# Altium schematic sheet supply.SchDoc
size A3; DocumentNumber: 41; SheetNumber: 41; SheetTotal: 45; SheetDescription: Board Power Supply
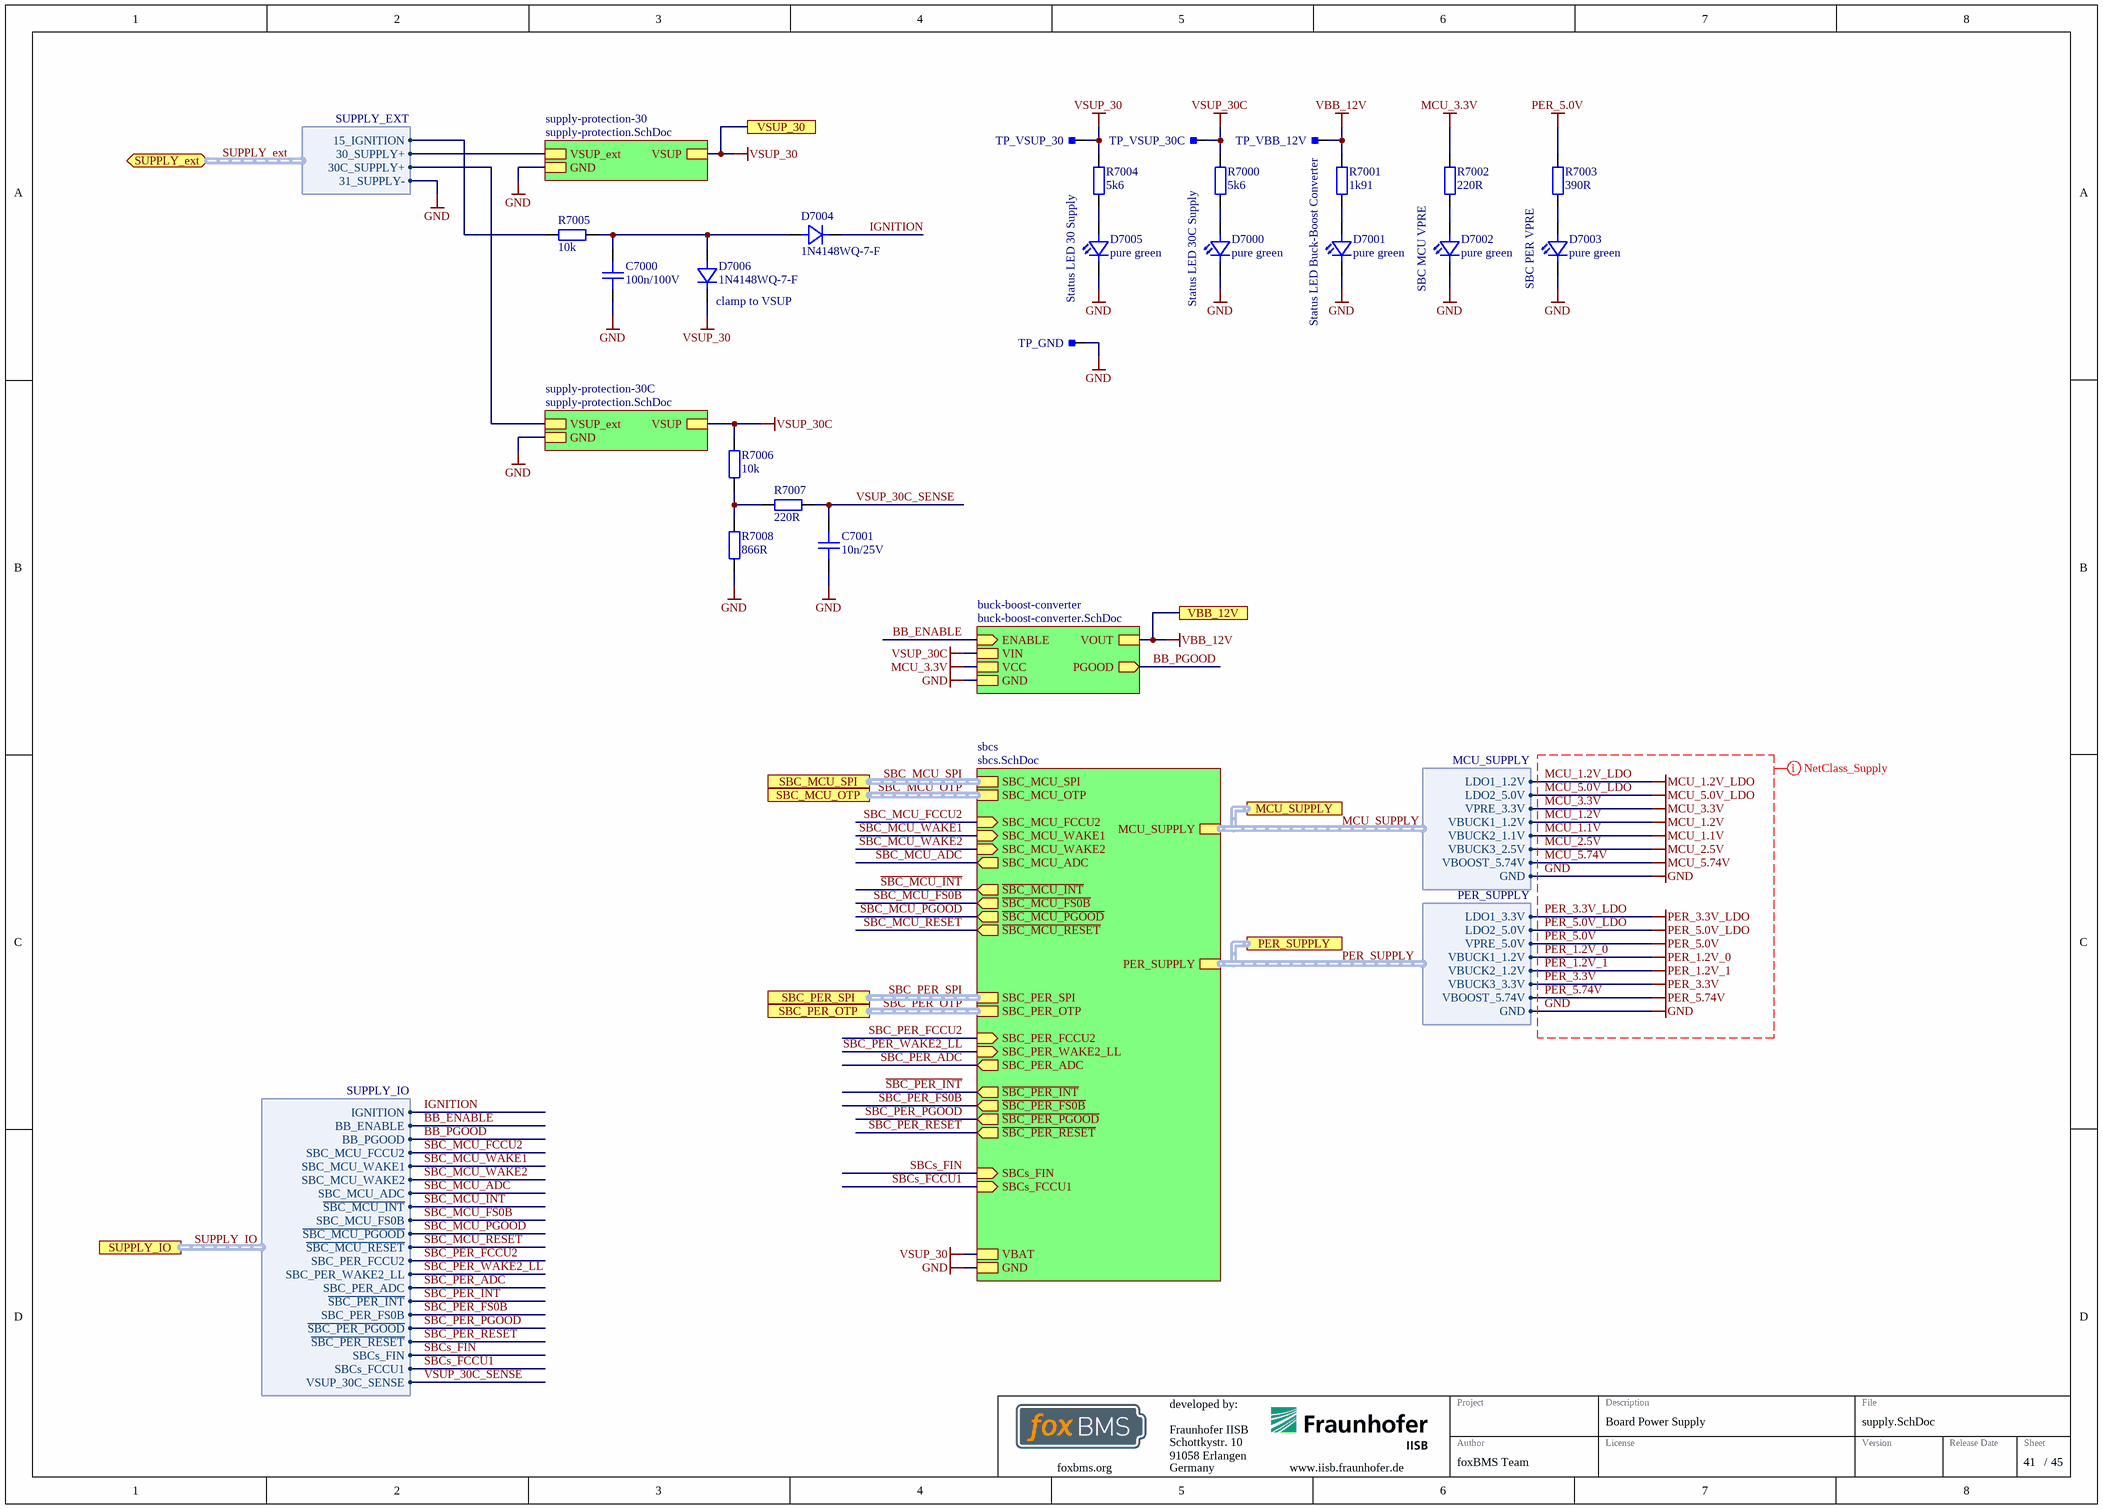
[diagram p0: supply.SchDoc]

## Parts
C7000  100n/100V  [CAPC1608X08N]
C7001  10n/25V  [CAPC1005X06N]
D7000  pure green  [LEDC1608X07N]
D7001  pure green  [LEDC1608X07N]
D7002  pure green  [LEDC1608X07N]
D7003  pure green  [LEDC1608X07N]
D7004  1N4148WQ-7-F  [SOD-123_CASE-425-04-ISSUE-G]
D7005  pure green  [LEDC1608X07N]
D7006  1N4148WQ-7-F  [SOD-123_CASE-425-04-ISSUE-G]
R7000  5k6  [RESC1005X04N]
R7001  1k91  [RESC1005X04N]
R7002  220R  [RESC1005X04N]
R7003  390R  [RESC1005X04N]
R7004  5k6  [RESC1005X04N]
R7005  10k  [RESC1005X04N]
R7006  10k  [RESC1005X04N]
R7007  220R  [RESC1005X04N]
R7008  866R  [RESC1005X04N]
TP_GND  Testpoint_Square  [Testpoint_S1]  (value not drawn)  (no BOM)
TP_VBB_12V  Testpoint_Square  [Testpoint_S1]  (value not drawn)  (no BOM)
TP_VSUP_30  Testpoint_Square  [Testpoint_S1]  (value not drawn)  (no BOM)
TP_VSUP_30C  Testpoint_Square  [Testpoint_S1]  (value not drawn)  (no BOM)

## Sub-sheets
buck-boost-converter = buck-boost-converter.SchDoc: VIN, VOUT, PGOOD (out), GND, VCC, ENABLE (in)
sbcs = sbcs.SchDoc: VBAT, GND, SBC_MCU_SPI (harness SPI), PER_SUPPLY (harness PER_SUPPLY), SBC_MCU_WAKE2 (in), SBC_PER_ADC (out), SBC_PER_OTP (harness SBC_OTP), SBC_MCU_FCCU2 (in), SBC_PER_FCCU2 (in), ~{SBC_PER_INT} (out), ~{SBC_MCU_FS0B} (out), ~{SBC_PER_FS0B} (out), SBC_MCU_ADC (out), ~{SBC_MCU_INT} (out), MCU_SUPPLY (harness MCU_SUPPLY), SBC_PER_WAKE2_LL (in), SBC_MCU_OTP (harness SBC_OTP), SBC_MCU_WAKE1 (in), SBC_PER_SPI (harness SPI), SBCs_FIN (in), ~{SBC_MCU_PGOOD} (out), ~{SBC_MCU_RESET} (out), SBCs_FCCU1 (in), ~{SBC_PER_PGOOD} (out), ~{SBC_PER_RESET} (out)
supply-protection-30 = supply-protection.SchDoc: VSUP, GND, VSUP_ext
supply-protection-30C = supply-protection.SchDoc: VSUP, GND, VSUP_ext

## Ports
MCU_SUPPLY (harness MCU_SUPPLY), PER_SUPPLY (harness PER_SUPPLY), SBC_MCU_OTP (harness SBC_OTP), SBC_MCU_SPI (harness SPI), SBC_PER_OTP (harness SBC_OTP), SBC_PER_SPI (harness SPI), SUPPLY_ext (bidir, harness SUPPLY_EXT), SUPPLY_IO (harness SUPPLY_IO), VBB_12V, VSUP_30

## Harnesses
MCU_SUPPLY: VBUCK1_1.2V, VBUCK2_1.1V, VBUCK3_2.5V, LDO1_1.2V, LDO2_5.0V, GND, VPRE_3.3V, VBOOST_5.74V
PER_SUPPLY: GND, VBOOST_5.74V, LDO1_3.3V, LDO2_5.0V, VPRE_5.0V, VBUCK1_1.2V, VBUCK2_1.2V, VBUCK3_3.3V
SUPPLY_IO: IGNITION, BB_ENABLE, BB_PGOOD, SBC_MCU_FCCU2, SBC_MCU_WAKE1, SBC_MCU_WAKE2, SBC_MCU_ADC, ~{SBC_MCU_INT}, SBC_MCU_FS0B, ~{SBC_MCU_PGOOD}, ~{SBC_MCU_RESET}, SBC_PER_FCCU2, SBC_PER_WAKE2_LL, SBC_PER_ADC, ~{SBC_PER_INT}, SBC_PER_FS0B, SBCs_FIN, SBCs_FCCU1, ~{SBC_PER_PGOOD}, ~{SBC_PER_RESET}, VSUP_30C_SENSE
SUPPLY_EXT: 30_SUPPLY+, 31_SUPPLY-, 15_IGNITION, 30C_SUPPLY+

## Nets
GND: C7000.1 C7001.1 D7000.1(C) D7001.1(C) D7002.1(C) D7003.1(C) D7005.1(C) R7008.1 TP_GND.1 ; sheet buck-boost-converter/GND, sheet supply-protection-30/GND, sheet sbcs/GND, sheet supply-protection-30C/GND, port MCU_SUPPLY.GND, port PER_SUPPLY.GND, port SUPPLY_ext.31_SUPPLY-
MCU_1.1V: port MCU_SUPPLY.VBUCK2_1.1V
MCU_1.2V: port MCU_SUPPLY.VBUCK1_1.2V
MCU_1.2V_LDO: port MCU_SUPPLY.LDO1_1.2V
MCU_2.5V: port MCU_SUPPLY.VBUCK3_2.5V
MCU_3.3V: R7002.2 ; sheet buck-boost-converter/VCC, port MCU_SUPPLY.VPRE_3.3V
MCU_5.0V_LDO: port MCU_SUPPLY.LDO2_5.0V
MCU_5.74V: port MCU_SUPPLY.VBOOST_5.74V
PER_1.2V_0: port PER_SUPPLY.VBUCK1_1.2V
PER_1.2V_1: port PER_SUPPLY.VBUCK2_1.2V
PER_3.3V: port PER_SUPPLY.VBUCK3_3.3V
PER_3.3V_LDO: port PER_SUPPLY.LDO1_3.3V
PER_5.0V: R7003.2 ; port PER_SUPPLY.VPRE_5.0V
PER_5.0V_LDO: port PER_SUPPLY.LDO2_5.0V
PER_5.74V: port PER_SUPPLY.VBOOST_5.74V
VBB_12V: R7001.2 TP_VBB_12V.1 ; port VBB_12V, sheet buck-boost-converter/VOUT
VSUP_30: D7006.1(K) R7004.2 TP_VSUP_30.1 ; port VSUP_30, sheet supply-protection-30/VSUP, sheet sbcs/VBAT
VSUP_30C: R7000.2 R7006.2 TP_VSUP_30C.1 ; sheet buck-boost-converter/VIN, sheet supply-protection-30C/VSUP
~{SBC_MCU_INT}: sheet sbcs/~{SBC_MCU_INT}, port SUPPLY_IO.~{SBC_MCU_INT}
~{SBC_MCU_PGOOD}: sheet sbcs/~{SBC_MCU_PGOOD}, port SUPPLY_IO.~{SBC_MCU_PGOOD}
~{SBC_MCU_RESET}: sheet sbcs/~{SBC_MCU_RESET}, port SUPPLY_IO.~{SBC_MCU_RESET}
~{SBC_PER_INT}: sheet sbcs/~{SBC_PER_INT}, port SUPPLY_IO.~{SBC_PER_INT}
~{SBC_PER_PGOOD}: sheet sbcs/~{SBC_PER_PGOOD}, port SUPPLY_IO.~{SBC_PER_PGOOD}
~{SBC_PER_RESET}: sheet sbcs/~{SBC_PER_RESET}, port SUPPLY_IO.~{SBC_PER_RESET}
BB_ENABLE: sheet buck-boost-converter/ENABLE, port SUPPLY_IO.BB_ENABLE
BB_PGOOD: sheet buck-boost-converter/PGOOD, port SUPPLY_IO.BB_PGOOD
IGNITION: D7004.1(K) ; port SUPPLY_IO.IGNITION
SBC_MCU_ADC: sheet sbcs/SBC_MCU_ADC, port SUPPLY_IO.SBC_MCU_ADC
SBC_MCU_FCCU2: sheet sbcs/SBC_MCU_FCCU2, port SUPPLY_IO.SBC_MCU_FCCU2
SBC_MCU_FS0B: sheet sbcs/~{SBC_MCU_FS0B}, port SUPPLY_IO.SBC_MCU_FS0B
SBC_MCU_WAKE1: sheet sbcs/SBC_MCU_WAKE1, port SUPPLY_IO.SBC_MCU_WAKE1
SBC_MCU_WAKE2: sheet sbcs/SBC_MCU_WAKE2, port SUPPLY_IO.SBC_MCU_WAKE2
SBC_PER_ADC: sheet sbcs/SBC_PER_ADC, port SUPPLY_IO.SBC_PER_ADC
SBC_PER_FCCU2: sheet sbcs/SBC_PER_FCCU2, port SUPPLY_IO.SBC_PER_FCCU2
SBC_PER_FS0B: sheet sbcs/~{SBC_PER_FS0B}, port SUPPLY_IO.SBC_PER_FS0B
SBC_PER_WAKE2_LL: sheet sbcs/SBC_PER_WAKE2_LL, port SUPPLY_IO.SBC_PER_WAKE2_LL
SBCs_FCCU1: sheet sbcs/SBCs_FCCU1, port SUPPLY_IO.SBCs_FCCU1
SBCs_FIN: sheet sbcs/SBCs_FIN, port SUPPLY_IO.SBCs_FIN
SUPPLY_ext.15_IGNITION: R7005.2 ; port SUPPLY_ext.15_IGNITION
SUPPLY_ext.30_SUPPLY+: sheet supply-protection-30/VSUP_ext, port SUPPLY_ext.30_SUPPLY+
SUPPLY_ext.30C_SUPPLY+: sheet supply-protection-30C/VSUP_ext, port SUPPLY_ext.30C_SUPPLY+
VSUP_30C_SENSE: C7001.2 R7007.2 ; port SUPPLY_IO.VSUP_30C_SENSE  [project net SUPPLY_IO.VSUP_30C_SENSE]
NetC7000_2: C7000.2 D7004.2(A) D7006.2(A) R7005.1
NetD7000_2: D7000.2(A) R7000.1
NetD7001_2: D7001.2(A) R7001.1
NetD7002_2: D7002.2(A) R7002.1
NetD7003_2: D7003.2(A) R7003.1
NetD7005_2: D7005.2(A) R7004.1
NetR7006_1: R7006.1 R7007.1 R7008.2

## Buses and harness runs
harness MCU_SUPPLY = port MCU_SUPPLY = sheet sbcs/MCU_SUPPLY
harness PER_SUPPLY = port PER_SUPPLY = sheet sbcs/PER_SUPPLY
harness SBC_MCU_OTP = port SBC_MCU_OTP = sheet sbcs/SBC_MCU_OTP
harness SBC_MCU_SPI = port SBC_MCU_SPI = sheet sbcs/SBC_MCU_SPI
harness SBC_PER_OTP = port SBC_PER_OTP = sheet sbcs/SBC_PER_OTP
harness SBC_PER_SPI = port SBC_PER_SPI = sheet sbcs/SBC_PER_SPI
harness SUPPLY_ext = port SUPPLY_ext
harness SUPPLY_IO = port SUPPLY_IO

## Layout directives
net class Supply_All: GND, MCU_1.1V, MCU_1.2V, MCU_1.2V_LDO, MCU_2.5V, MCU_3.3V, MCU_5.0V_LDO, MCU_5.74V, PER_1.2V_0, PER_1.2V_1, PER_3.3V, PER_3.3V_LDO, PER_5.0V, PER_5.0V_LDO, PER_5.74V

## Notes on the sheet
- Status LED 30 Supply
- Status LED 30C Supply
- (near TP_VBB_12V) Status LED Buck-Boost Converter
- SBC MCU VPRE
- SBC PER VPRE
- (near D7006) clamp to VSUP
- Fraunhofer IISB
- Schottkystr. 10
- developed by:
- 91058 Erlangen
- Germany
- Author
- Project
- License
- Description
- File
- Version
- Release Date
- Sheet
- foxbms.org <https://foxbms.org>
- www.iisb.fraunhofer.de <https://www.iisb.fraunhofer.de/>
- foxBMS Team
- /

## Library data of the parts
C7000 = gen_C_ceramic_100n_100V_X7R_0603: MLCC; Capacitance: 100n; Rated Voltage: 100V; Dielectric: X7R; Case EIA: 0603; Case Metric: 1608; Automotive Qualified: True; PnP Package: 0603C; Part Number: gen_C_ceramic_100n_100V_X7R_0603; Supplier 1: Digikey; Supplier Part Number 1: 490-13420-1-ND; Supplier 2: Mouser; Supplier Part Number 2: 81-GCJ188R72A104KA1D
C7001 = gen_C_ceramic_10n_25V_X7R_0402: MLCC; Capacitance: 10n; Rated Voltage: 25V; Dielectric: X7R; Case EIA: 0402; Case Metric: 1005; PnP Package: 0402C; PnP Value: 10nF/25V/X7R; PnP equipped: x; Automotive Qualified: True; Part Number: gen_C_ceramic_10n_25V_X7R_0402; Supplier 1: Farnell; Supplier Part Number 1: 2210793
D7000-D7003 D7005 = LED_0603_pure_green_AECQ: TLMP1100-GS08; Manufacturer: Vishay; Breakdown Voltage: 5V; Continuous Forward Current: 20mA; Forward Voltage @ 20mA: 2.1V; Automotive Qualified: True; Part Number: LED_0603_pure_green_AECQ; Color: pure green; Operating Temperature: -40°C - 100°C; ComponentLink1Description: Datasheet; ComponentLink1URL: http://www.farnell.com/datasheets/2049164.pdf; Supplier 1: Farnell; Supplier Part Number 1: 1328306; Supplier 2: Digikey; Supplier Part Number 2: 751-1176-1-ND; PnP Package: LED_0603
D7004 D7006 = 1N4148WQ-7-F: Diode; Manufacturer: Diodes Inc.; Breakdown Voltage: 100V; Continuous Forward Current: 300mA; PnP Package: SOD123; Automotive Qualified: True; Part Number: 1N4148WQ-7-F; Part Name: 1N4148WQ-7-F; Operating Temperature: -65°C - +150°C; ComponentLink1Description: Datasheet; ComponentLink1URL: https://www.diodes.com/assets/Datasheets/ds30086.pdf; Supplier 1: Digikey; Supplier Part Number 1: 1N4148WQ-7-FDICT-ND
R7000 R7004 = gen_R_5k6_0402: SMD Resistor 5k6 0402; Tolerance: 1%; Power: 0.063W; Case EIA: 0402; Case Metric: 1005; Maximum Working Voltage: 50V; PnP Package: 0402R; Automotive Qualified: True; AEC-Q Norm: AEC-Q200; AEC-Q Grade: Grade 0; Part Number: gen_R_5k6_0402; Operating Temperature: -55°C - +155°C; Resistance: 5k6; Series: E24; PnP Value: 5k6; Supplier 1: Digikey; Supplier Part Number 1: A129636CT-ND; ECCN: EAR99
R7001 = gen_R_1k91_0402: SMD Resistor 1k91 0402; Tolerance: 1%; Power: 0.063W; Case EIA: 0402; Case Metric: 1005; Maximum Working Voltage: 50V; PnP Package: 0402R; Automotive Qualified: True; AEC-Q Grade: Grade 0; AEC-Q Norm: AEC-Q200; Part Number: gen_R_1k91_0402; Operating Temperature: -55°C - +155°C; Resistance: 1k91; Series: E96; PnP Value: 1k91; ECCN: EAR99; Supplier 1: Digikey; Supplier Part Number 1: P1.91KLCT-ND
R7002 = gen_R_220R_0402: SMD Resistor 220R 0402; Tolerance: 1%; Power: 0.063W; Case EIA: 0402; Case Metric: 1005; Maximum Working Voltage: 50V; PnP Package: 0402R; Automotive Qualified: True; AEC-Q Norm: AEC-Q200; AEC-Q Grade: Grade 0; Part Number: gen_R_220R_0402; Operating Temperature: -55°C - +155°C; Resistance: 220R; Series: E24; PnP Value: 220R; Supplier 1: Digikey; Supplier Part Number 1: A129619CT-ND; ECCN: EAR99
R7003 = gen_R_390R_0402: SMD Resistor 390R 0402; Tolerance: 1%; Power: 0.063W; Case EIA: 0402; Case Metric: 1005; Maximum Working Voltage: 50V; PnP Package: 0402R; Automotive Qualified: True; AEC-Q Grade: Grade 0; AEC-Q Norm: AEC-Q200; Part Number: gen_R_390R_0402; Operating Temperature: -55°C - +155°C; Resistance: 390R; Series: E24; PnP Value: 390R; ECCN: EAR99; Supplier 1: Farnell; Supplier Part Number 1: 2563565
R7005 = gen_R_10k_0402: SMD Resistor 10k 0402; Tolerance: 1%; Power: 0.063W; Case EIA: 0402; Case Metric: 1005; Maximum Working Voltage: 50V; PnP Package: 0402R; PnP equipped: x; Automotive Qualified: True; AEC-Q Norm: AEC-Q200; Part Number: gen_R_10k_0402; Operating Temperature: -55°C - +155°C; Resistance: 10k; Series: E24, E96; PnP Value: 10k; Supplier 1: Farnell; Supplier Part Number 1: 2059239; ECCN: EAR99
R7006 = gen_R_10k_0402: SMD Resistor 10k 0402; Tolerance: 1%; Power: 0.063W; Case EIA: 0402; Case Metric: 1005; Maximum Working Voltage: 50V; PnP Package: 0402R; Automotive Qualified: True; AEC-Q Norm: AEC-Q200; PnP equipped: x; Part Number: gen_R_10k_0402; Operating Temperature: -55°C - +155°C; Resistance: 10k; Series: E24, E96; PnP Value: 10k; ECCN: EAR99; Supplier 1: Farnell; Supplier Part Number 1: 2059239
R7007 = gen_R_220R_0402: SMD Resistor 220R 0402; Tolerance: 1%; Power: 0.063W; Case EIA: 0402; Case Metric: 1005; Maximum Working Voltage: 50V; PnP Package: 0402R; Automotive Qualified: True; AEC-Q Grade: Grade 0; AEC-Q Norm: AEC-Q200; Part Number: gen_R_220R_0402; Operating Temperature: -55°C - +155°C; Resistance: 220R; Series: E24; PnP Value: 220R; ECCN: EAR99; Supplier 1: Digikey; Supplier Part Number 1: A129619CT-ND
R7008 = gen_R_866R_0402: SMD Resistor 866R 0402; Tolerance: 1%; Power: 0.063W; Case EIA: 0402; Case Metric: 1005; Maximum Working Voltage: 50V; PnP Package: 0402R; Automotive Qualified: True; AEC-Q Grade: Grade 0; AEC-Q Norm: AEC-Q200; Part Number: gen_R_866R_0402; Operating Temperature: -55°C - +155°C; Resistance: 866R; Series: E96; PnP Value: 866R; ECCN: EAR99; Supplier 1: Farnell; Supplier Part Number 1: 2302631
TP_GND TP_VBB_12V TP_VSUP_30 TP_VSUP_30C = Testpoint_Square: Testpoint, square; Automotive Qualified: False; Part Number: Testpoint_Square